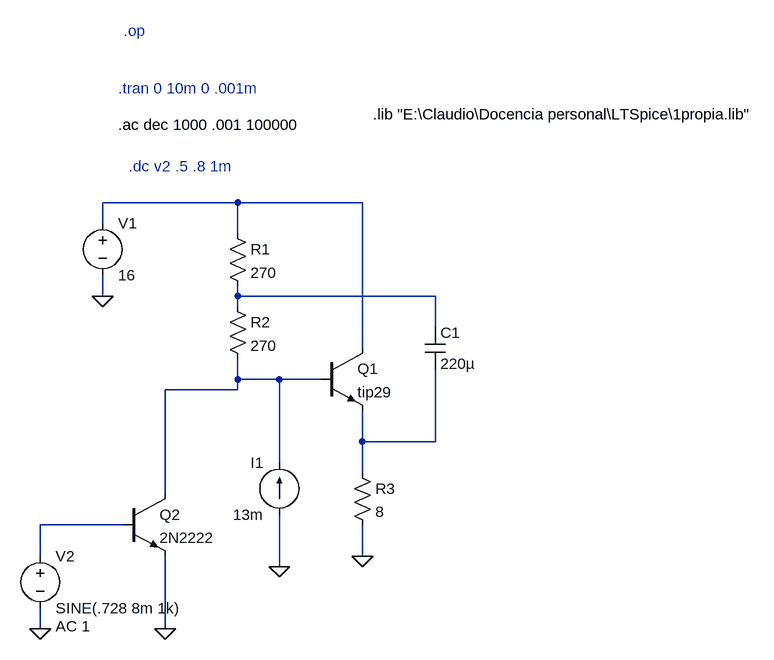
[diagram p0: schematic bootstrap1.asc]
bootstrap1.asc, the LTspice schematic file:
Version 4
SHEET 1 1140 680
WIRE 144 -32 -64 -32
WIRE 336 -32 144 -32
WIRE -64 0 -64 -32
WIRE 144 16 144 -32
WIRE -64 112 -64 80
WIRE 144 112 144 96
WIRE 448 112 144 112
WIRE 144 128 144 112
WIRE 448 160 448 112
WIRE 336 192 336 -32
WIRE 144 240 144 208
WIRE 208 240 144 240
WIRE 272 240 208 240
WIRE 144 256 144 240
WIRE 144 256 32 256
WIRE 336 336 336 288
WIRE 448 336 448 224
WIRE 448 336 336 336
WIRE 208 368 208 240
WIRE 336 384 336 336
WIRE 32 416 32 256
WIRE -32 464 -160 464
WIRE -160 512 -160 464
WIRE 336 512 336 464
WIRE 208 528 208 448
WIRE -160 624 -160 592
WIRE 32 624 32 512
FLAG -64 112 0
FLAG 336 512 0
FLAG 32 624 0
FLAG -160 624 0
FLAG 208 528 0
DATAFLAG 400 336 ""
DATAFLAG 192 240 ""
DATAFLAG 256 112 ""
SYMBOL res 128 0 R0
SYMATTR InstName R1
SYMATTR Value 270
SYMBOL res 128 112 R0
SYMATTR InstName R2
SYMATTR Value 270
SYMBOL voltage -64 -16 R0
WINDOW 123 24 124 Left 2
WINDOW 39 0 0 Left 0
SYMATTR InstName V1
SYMATTR Value 16
SYMBOL res 320 368 R0
SYMATTR InstName R3
SYMATTR Value 8
SYMBOL cap 432 160 R0
SYMATTR InstName C1
SYMATTR Value 220µ
SYMBOL npn -32 416 R0
SYMATTR InstName Q2
SYMATTR Value 2N2222
SYMBOL voltage -160 496 R0
WINDOW 123 24 124 Left 2
WINDOW 39 0 0 Left 0
SYMATTR Value2 AC 1
SYMATTR InstName V2
SYMATTR Value SINE(.728 8m 1k)
SYMBOL npn 272 192 R0
SYMATTR InstName Q1
SYMATTR Value tip29
SYMBOL current 208 448 R180
WINDOW 0 24 80 Left 2
WINDOW 3 24 0 Left 2
WINDOW 123 0 0 Left 0
WINDOW 39 0 0 Left 0
SYMATTR InstName I1
SYMATTR Value 13m
TEXT -32 -296 Left 2 ;.op
TEXT -40 -152 Left 2 !.ac dec 1000 .001 100000
TEXT -24 -88 Left 2 ;.dc v2 .5 .8 1m
TEXT -40 -208 Left 2 ;.tran 0 10m 0 .001m
TEXT 352 -168 Left 2 !.lib "E:\\Claudio\\Docencia personal\\LTSpice\\1propia.lib"

The netlist it stands for:
* bootstrap1.asc
R1 N001 N002 270
R2 N002 N003 270
V1 N001 0 16
R3 N004 0 8
C1 N002 N004 220µ
Q2 N003 N005 0 0 2N2222
V2 N005 0 SINE(.728 8m 1k) AC 1
Q1 N001 N003 N004 0 tip29
I1 0 N003 13m
.model NPN NPN
.model PNP PNP
.lib standard.bjt
* .op
.ac dec 1000 .001 100000
* .dc v2 .5 .8 1m
* .tran 0 10m 0 .001m
.lib "E:\Claudio\Docencia personal\LTSpice\1propia.lib"
.backanno
.end